# Altium schematic sheet Énigme2_Crocodile.SchDoc
size Tabloid; Date: Date; Author: Author 1; DocumentNumber: 5; Revision: 1; SheetNumber: 5; SheetTotal: 7; Size: 11x17; Sheet_Name: Énigme2_Pince_Banane; SPICEModelCacheRTYEHROU: <root> / <DocumentId>RTYEHROU</DocumentId> / </root>
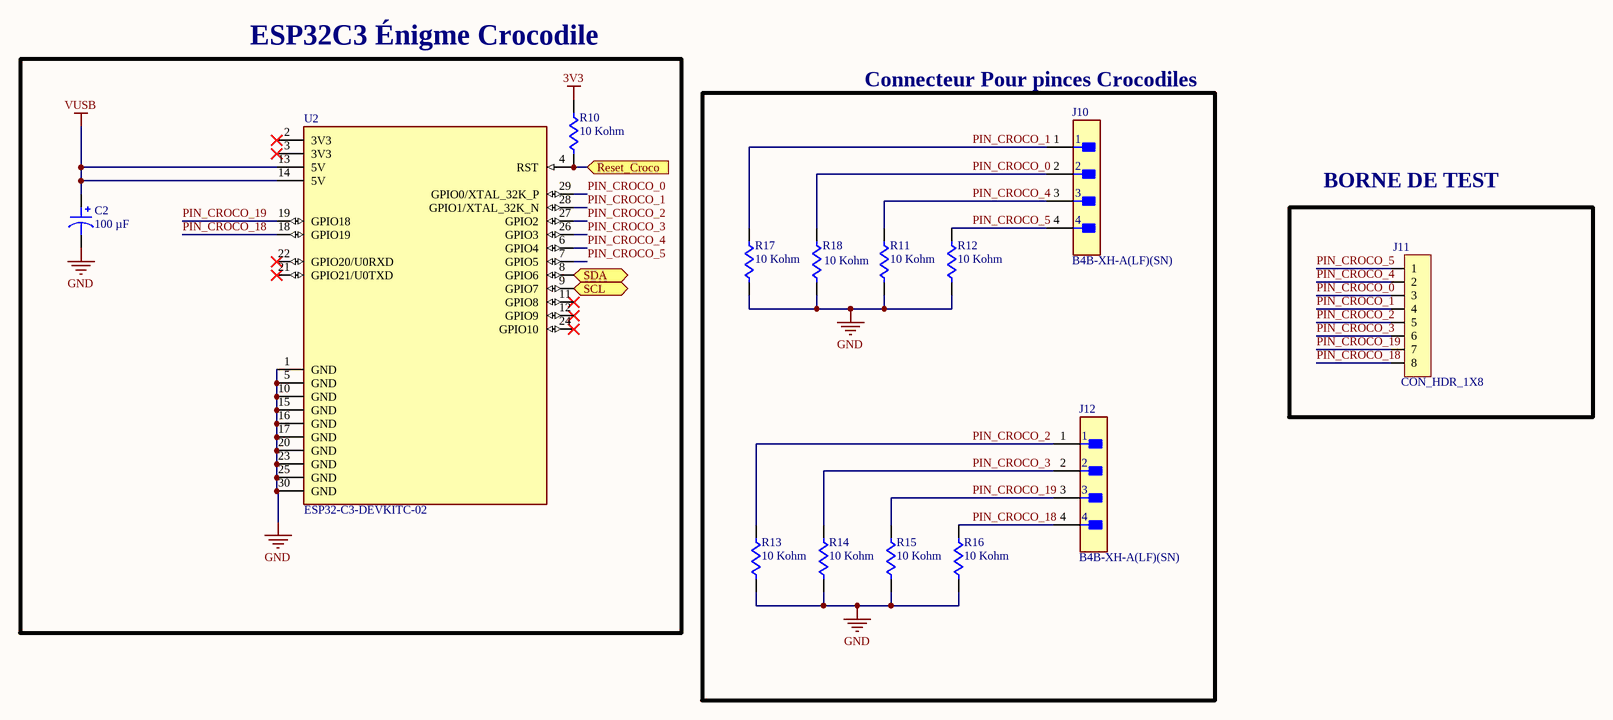
[diagram p0: Énigme2_Crocodile.SchDoc]

## Parts
C2  100 µF  [CAP AL TH D8 L3.5 H12.5]
J10  B4B-XH-A(LF)(SN)  [FP-B4B-XH-A_LF_SN-MFG]
J11  CON_HDR_1X8  [CON_HDR_1x8]
J12  B4B-XH-A(LF)(SN)  [FP-B4B-XH-A_LF_SN-MFG]
R10  10 Kohm  [Res_Template]
R11  10 Kohm  [Res_Template]
R12  10 Kohm  [Res_Template]
R13  10 Kohm  [Res_Template]
R14  10 Kohm  [Res_Template]
R15  10 Kohm  [Res_Template]
R16  10 Kohm  [Res_Template]
R17  10 Kohm  [Res_Template]
R18  10 Kohm  [Res_Template]
U2  ESP32-C3-DEVKITC-02  [XCVR_ESP32-C3-DEVKITC-02]

## Blocks framed on the sheet
ESP32C3 Énigme Crocodile: C2 R10 U2
Connecteur Pour pinces Crocodiles: J10 J12 R11-R18
BORNE DE TEST: J11

## Ports
Reset_Croco (in), SCL (bidir), SDA (bidir)

## Nets
3V3: R10.2
GND: C2.2 R11.1 R12.1 R13.1 R14.1 R15.1 R16.1 R17.1 R18.1 U2.1(GND) U2.5(GND) U2.10(GND) U2.15(GND) U2.16(GND) U2.17(GND) U2.20(GND) U2.23(GND) U2.25(GND) U2.30(GND)
VUSB: C2.1 U2.13(5V) U2.14(5V)
PIN_CROCO_0: J10.2 J11.3 R18.2 U2.29(GPIO0/XTAL_32K_P)
PIN_CROCO_1: J10.1 J11.4 R17.2 U2.28(GPIO1/XTAL_32K_N)
PIN_CROCO_2: J11.5 J12.1 R13.2 U2.27(GPIO2)
PIN_CROCO_3: J11.6 J12.2 R14.2 U2.26(GPIO3)
PIN_CROCO_4: J10.3 J11.2 R11.2 U2.6(GPIO4)
PIN_CROCO_5: J10.4 J11.1 R12.2 U2.7(GPIO5)
PIN_CROCO_18: J11.8 J12.4 R16.2 U2.18(GPIO19)
PIN_CROCO_19: J11.7 J12.3 R15.2 U2.19(GPIO18)
Reset_Croco: R10.1 U2.4(RST) ; port Reset_Croco
SCL: U2.9(GPIO7) ; port SCL
SDA: U2.8(GPIO6) ; port SDA

Not connected (* = marked no-connect by the designer): U2 2(3V3)* 3(3V3)* 11(GPIO8)* 12(GPIO9)* 21(GPIO21/U0TXD)* 22(GPIO20/U0RXD)* 24(GPIO10)*

## Notes on the sheet
- Nom de la feuille
- Titre du projet
- Cours associé au projet
- Taille
- Département
- Technologies du
- Révision
- PCB
- .
- SCH
- Date
- génie électrique
- Feuille
- Variant
- de
- Concepteurs

## Library data of the parts
C2 = 860020674015: CAP ALUM 100UF 20% 50V RADIAL; manufacturer: Würth Elektronik; Lifetime @ Temp.: 2000 Hrs @ 105°C; Polarization: Polar; Ripple Current @ High Frequency: 306 mA @ 100 kHz; Ripple Current @ Low Frequency: 200 mA @ 120 Hz; Part Number: 860020674015; Applications: General Purpose; Capacitance: 100 µF; componentlink1description: Datasheet; componentlink1url: https://katalog.we-online.de/pbs/datasheet/860020674015.pdf; componentlink2description: DigiKey Link; componentlink2url: https://www.digikey.com/en/products/detail/würth-elektronik/860020674015/5727098; Device Package: Radial, Can; Height - Seated (Max): 0.492" (12.50mm); lastupdated: 2024-06-03 20:06:11; Lead Spacing: 0.138" (3.50mm); Lifecycle Status: Active; Minimum Order: 1; Mounting Type: Through Hole; Operating Temperature: -40°C ~ 105°C; Package / Case: Radial, Can; packaging: TapeAndBox; partid: 7238; Part Status: Active; price: 0.16; series: WCAP-ATG5; Size / Dimension: 0.315" Dia (8.00mm); Supplier 1: DigiKey; Supplier Part Number 1: 732-8861-1-ND; Tolerance: ±20%; value: 100 µF; Voltage - Rated: 50 V
J10 J12 = CMP-17439-000250-1: CONN HEADER VERT 4POS 2.5MM; Number of Contacts: 4; Contact Resistance: 20mR; Voltage Rating: 250V; Max Current Rating: 3A; Gender: Male; Wire/Cable Gauge: 22AWG; Mated Stacking Heights: 9.8mm; Insulation Resistance: 1GR; Orientation: Straight; Contact Type: Male Pin; Contact Finish - Mating: TIN; Series: XH; Max Voltage Rating (AC): 250V; Lead Pitch: 2.5mm; Contact Shape: Square; Insulation Color: Natural; Termination: Solder; Lead Free: Lead Free; Voltage Rating (AC): 250V; Number of Rows: 1; Flammability Rating: UL94 V-0; Number of Positions: 4; Max Operating Temperature: 85°C; Package Quantity: 500; Mount: Through Hole; REACH SVHC: No SVHC; Connector Type: Header; Insulation Material: Nylon; Fastening Type: Detent; Min Operating Temperature: -25°C; Housing Color: White; Packaging: Bulk; Contact Plating: Tin; Contact Material: Brass; Max Voltage Rating (DC): 250V; Housing Material: Polyamide; Color: Natural; Material: Polyamide; Pitch: 2.5mm; Depth: 5.75mm; Current Rating: 3A; Length: 12.4mm
J11 = CMP-005-000004-1: CON - Header 1X8 pins, 100Mils - TH-8; Polarized: No; Note: *; Power Max: *; Component Type: Standard; Manufacturer #1: *; Design Item ID: CON_HDR_1X8; Assembly Type: TH; HelpURL: *; Pin Count: 8; Package: TH-8; Source: CEGEP_SHERBROOKE_TGE_LIBRARY.SchLib
R10-R18 = 470 ohm: Custom Semiconductor Resistor
U2 = ESP32-C3-DEVKITC-02: Development Boards & Kits - Wireless (Engineering Samples) ESP32-C3 General-Purpose Development Board, embeds ESP32-C3-WROOM-02, 4 MB Flash, with Pin Header; MF: Espressif Systems; Purchase-URL: https://www.digikey.ca/en/products/detail/espressif-systems/ESP32-C3-DEVKITC-02/14553009?gclsrc=aw.ds&&utm_adgroup=&utm_source=google&utm_medium=cpc&utm_campaign=PMax%20Product_Low%20ROAS%20Categories&utm_term=&productid=14553009&utm_content=&utm_id=go_cmp-20291741422_adg-_ad-__dev-c_ext-_prd-14553009_sig-CjwKCAiAh6y9BhBREiwApBLHC_cF2gDRygapSaJLXU2Wdnx3_ghIaBBBCKe6dQeqHq45MeITmry7OBoCG4EQAvD_BwE&gad_source=1&gclid=CjwKCAiAh6y9BhBREiwApBLHC_cF2gDRygapSaJLXU2Wdnx3_ghIaBBBCKe6dQeqHq45MeITmry7OBoCG4EQAvD_BwE; Package: None; MP: ESP32-C3-DevKitC-02; Price: 12.94$; Availability: In Stock; SnapEDA_Link: https://www.snapeda.com/parts/ESP32-C3-DevKitC-02/Espressif+Systems/view-part/?ref=snap; Check_prices: https://www.snapeda.com/parts/ESP32-C3-DevKitC-02/Espressif+Systems/view-part/?ref=eda; ComponentLink1Description: New link; ComponentLink1URL: https://docs.espressif.com/projects/esp-idf/en/v5.2/esp32c3/hw-reference/esp32c3/user-guide-devkitc-02.html